# EAGLE design PCB_Power (EAGLE 9.6.2)
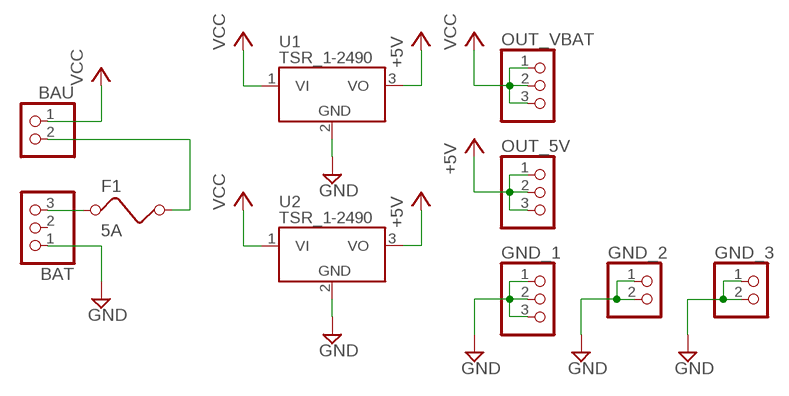
[diagram p0: schematic, sheet 1]

## Parts
BAT  TERMINALBLOCK_1X3-5.0MM  [TERMINALBLOCK_1X3-5.0MM]
BAU  TERMINALBLOCK_1X2-5.0MM  [TERMINALBLOCK_1X2-5.0MM]
F1  5A  FUSE  [FUSE]
GND_1  TERMINALBLOCK_1X3-5.0MM  [TERMINALBLOCK_1X3-5.0MM]
GND_2  TERMINALBLOCK_1X2-5.0MM  [TERMINALBLOCK_1X2-5.0MM]
GND_3  TERMINALBLOCK_1X2-5.0MM  [TERMINALBLOCK_1X2-5.0MM]
OUT_5V  TERMINALBLOCK_1X3-5.0MM  [TERMINALBLOCK_1X3-5.0MM]
OUT_VBAT  TERMINALBLOCK_1X3-5.0MM  [TERMINALBLOCK_1X3-5.0MM]
U1  TSR_1-2490  [TSR-1]
U2  TSR_1-2490  [TSR-1]

## Nets
+5V [PWR]: OUT_5V.1 OUT_5V.2 OUT_5V.3 U1.3(VO) U2.3(VO)
B_IN [BAT_IN]: BAT.3 F1.1
F [PWR]: BAU.2 F1.2
GND: BAT.1 GND_1.1 GND_1.2 GND_1.3 GND_2.1 GND_2.2 GND_3.1 GND_3.2 U1.2(GND) U2.2(GND)
VCC [PWR]: BAU.1 OUT_VBAT.1 OUT_VBAT.2 OUT_VBAT.3 U1.1(VI) U2.1(VI)
Unconnected: BAT.2

## Library data of the parts
BAT GND_1 OUT_5V OUT_VBAT = TerminalBlock:TERMINALBLOCK_1X3-5.0MM: 1x3-5.0MM TERMINAL BLOCK Simple screw terminal. 3 pins with 5.0mm pitch; PITCH: 5mm
BAU GND_2 GND_3 = TerminalBlock:TERMINALBLOCK_1X2-5.0MM: 1x2-5.0MM TERMINAL BLOCK Simple screw terminal. 2 pins with 5.0mm pitch; PITCH: 5mm
F1 = special:FUSE: FUSE 5 x 20 mm
U1 U2 = _traco_tsr-1:TSR_1-*: TRACO TSR-1 Series Point-of-Load DC/DC-Converters Vi max. 36 V; Vo = (1.2 .. 15)V ±2%; Io = 0 .. 1 A SIP-Package (drop-in replacement for 78xx linear voltage regulators in TO220-package, vertically assembled) Source: www.tracopower.com Technologies: TSR 1- Vi (V) Vo (V) ±2% Io = 0 .. 1 A 24_ ( generic ) 2412 4.6 .. 36 1.2 2415 4.6 .. 36 1.5 2418 4.6 .. 36 1.8 2425 4.6 .. 36 2.5 2433 4.75.. 36 3.3 2450 6.5 .. 36 5.0 2465 9.0 .. 36 6.5 2490 12 .. 36 9.0 24120 15 .. 36 12 24150 18 .. 36 15 Author: Dipl.-Ing. FH Rainer Bayer HHN Hochschule Heilbronn, rainer.bayer@hs-heilbronn.de Ingenieurbüro ing-rb, mail@ing-rb.de

## Net classes
1 BAT_IN: clearance 2.54 mm
2 PWR: clearance 1.27 mm

## Board
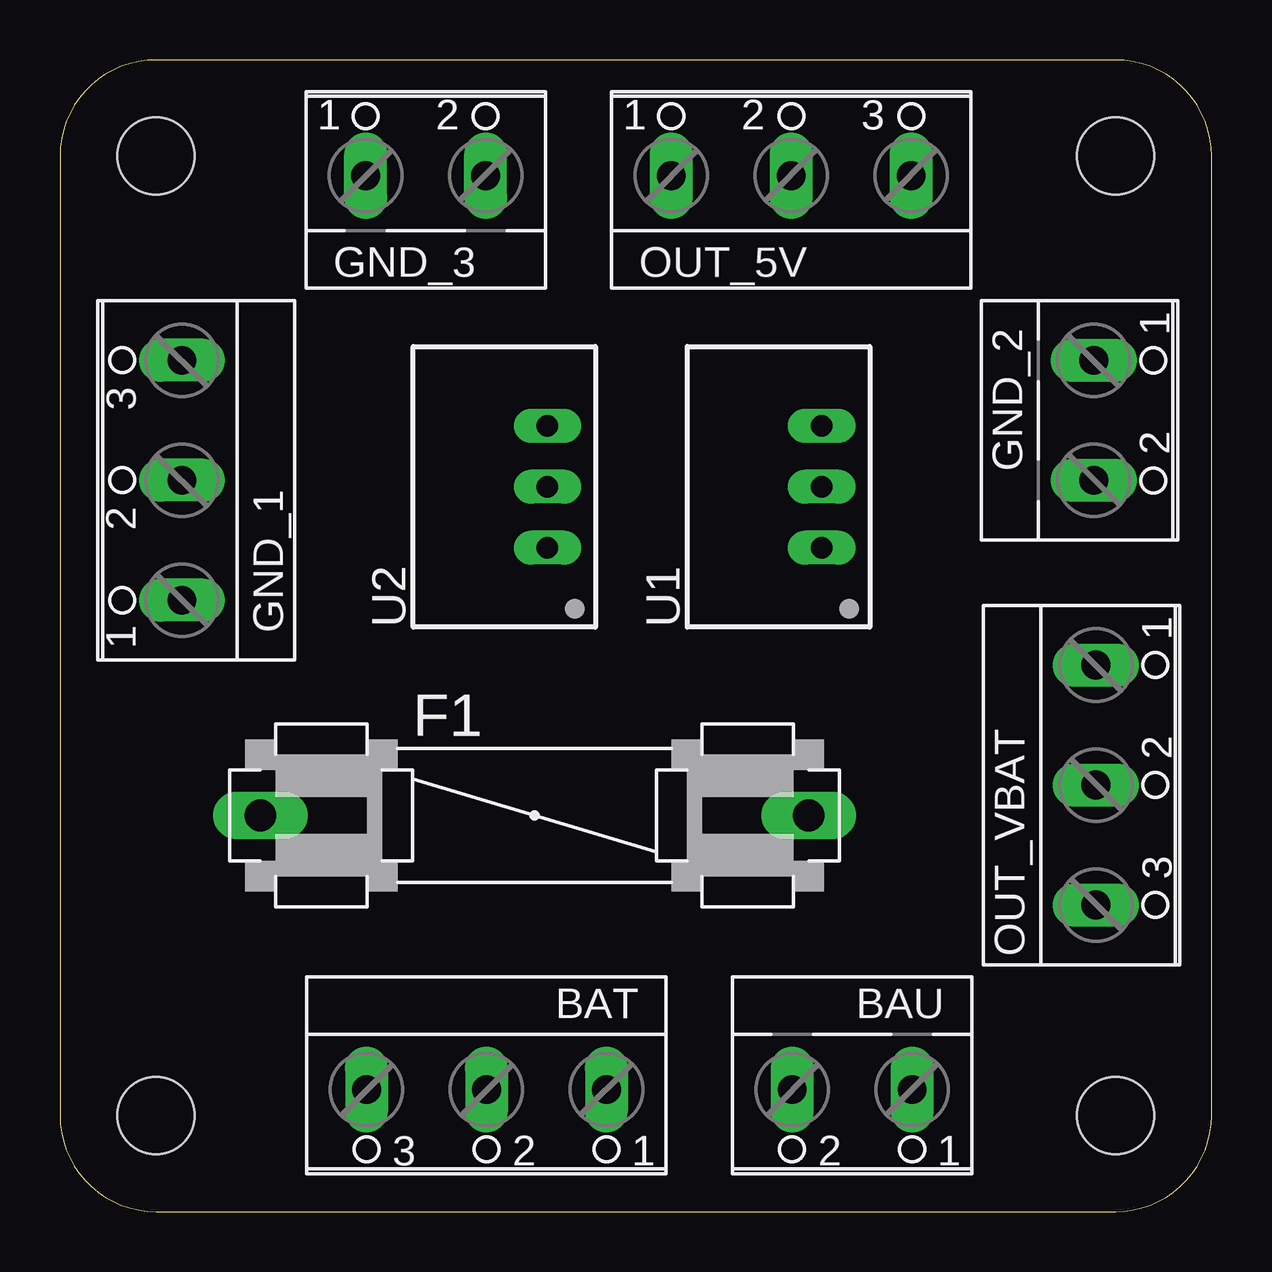
[diagram p1: board, top side]
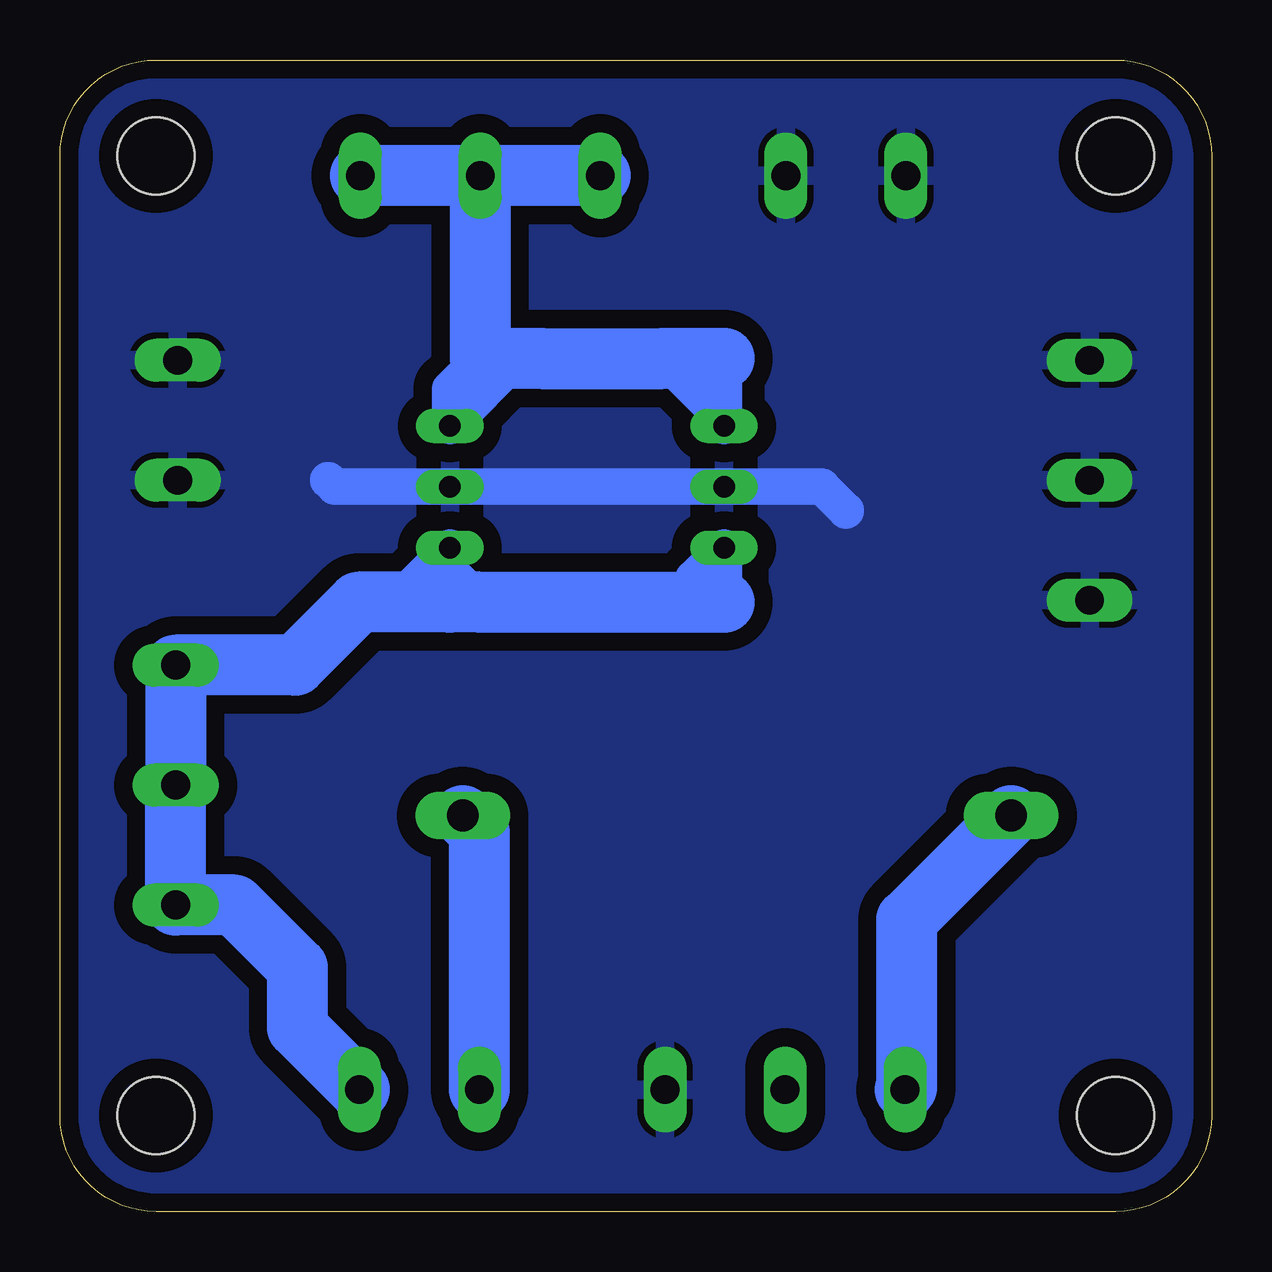
[diagram p2: board, bottom side, seen from below]

Size 48 x 48 mm. Coordinates in mm from the lower left corner, seen from the top.
Outline: 4,0 44,0 arc90 48,4 48,44 arc90 44,48 4,48 arc90 0,44 0,4 arc90 4,0
Copper layers (1*16): Top 0.035mm / dielectric 1.5mm / Bottom 0.035mm
Design rules "default *": minimum track width 6mil, minimum drill 0.35mm, track to track 6mil, track to pad 6mil, pad to pad 6mil, via to via 6mil, smd to smd 6mil, copper to edge 30mil, drill to drill 6mil, minimum pad ring 10mil, minimum via ring 8mil, stop-mask expansion 4mil, vias tented up to drill 0mil, thermal gap 10mil
Holes 3.2 mm at 4,4 44,4 44,44 4,44

### Footprints (pad centres in the part's own frame; a part is rotated, then mirrored left to right if it is on the bottom)
TERMINALBLOCK_1X3-5.0MM = drill 1.2 long: 1 -5,0; 2 0,0; 3 5,0
TERMINALBLOCK_1X2-5.0MM = drill 1.2 long: 1 -2.5,0; 2 2.5,0
FUSE = drill 1.321 long: 1 -11.43,0; 2 11.43,0
TSR-1 = drill 0.9 long: 1 -2.54,0; 2 0,0; 3 2.54,0

### Placement (x,y rotation side)
BAT  17.78,5.08 180 top
BAU  33.02,5.08 180 top
F1  19.78,16.51 0 top
GND_1  5.08,30.48 90 top
GND_2  43.09,32.98 270 top
GND_3  15.24,43.18 0 top
OUT_5V  30.48,43.18 0 top
OUT_VBAT  43.18,17.78 270 top
U1  31.75,30.21 90 top
U2  20.32,30.21 90 top

### Tracks (layer width: path | path; a pad name or v marks a point on that pad's centre or on a via)
+5V
  Bottom 1.524: 30.48,35.56 31.75,34.29 U1.3 28.94,35.56 27.94,35.56 | 22.86,35.56 20.32,33.02 U2.3 20.32,35.56
  Bottom 2.54: OUT_5V.1 OUT_5V.2 | OUT_5V.2 OUT_5V.3 | OUT_5V.2 30.48,35.56 27.94,35.56 22.86,35.56 20.32,35.56
B_IN
  Bottom 2.54: F1.1 12.7,12.16 12.7,5.16 BAT.3
F
  Bottom 2.54: BAU.2 30.52,15.82 F1.2
GND
  Bottom 1.524: 15.24,29.21 16.24,30.21 U2.2 U1.2 36.56,30.21 36.83,30.48
  pour Bottom (isolate 0.762): 0,4 arc90 4,0 44,0 arc90 48,4 48,44 arc90 44,48 4,48 arc90 0,44
  pour Bottom: 24.13,8.26 27.3,11.43 27.3,12.7 16.51,23.5 13.97,23.5 13.97,40.64 9.53,40.64 9.53,20.95 10.16,20.32 11.43,20.32 23.5,8.26
VCC
  Bottom 1.524: U1.1 31.75,25.4 | U1.1 31.75,26.67 30.48,25.4 | 21.59,25.4 21.59,26.4 U2.1 20.32,25.4 | 35.56,25.4 34.02,25.4 U1.1
  Bottom 2.54: BAU.1 38.1,7.66 38.1,10.16 40.72,12.78 OUT_VBAT.3 OUT_VBAT.2 OUT_VBAT.1 38.18,22.78 35.56,25.4 31.75,25.4 30.48,25.4 21.59,25.4 20.32,25.4

### Text on the board
bRestrict: Robotik 2022 | By Flowpy